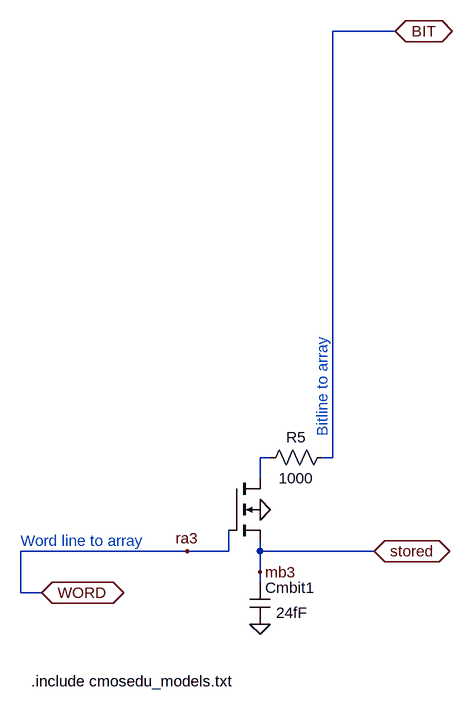
[diagram p0: schematic DRAM_cell.asc]
DRAM_cell.asc, the LTspice schematic file:
Version 4
SHEET 1 1952 1352
WIRE 1408 -528 1312 -528
WIRE 1216 128 1200 128
WIRE 1312 128 1312 -528
WIRE 1312 128 1296 128
WIRE 1200 160 1200 128
WIRE 1088 272 832 272
WIRE 1152 272 1152 240
WIRE 1152 272 1088 272
WIRE 1200 272 1200 256
WIRE 1376 272 1200 272
WIRE 1200 304 1200 272
WIRE 1200 320 1200 304
WIRE 832 336 832 272
WIRE 864 336 832 336
FLAG 1200 208 0
FLAG 1200 384 0
FLAG 1200 304 mb3
FLAG 1088 272 ra3
FLAG 1408 -528 BIT
IOPIN 1408 -528 BiDir
FLAG 864 336 WORD
IOPIN 864 336 BiDir
FLAG 1376 272 stored
IOPIN 1376 272 BiDir
SYMBOL nmos4 1152 160 R0
WINDOW 0 104 24 Invisible 2
WINDOW 3 179 41 Invisible 2
SYMATTR InstName M8
SYMATTR Value nmos45lp
SYMATTR Value2 l=0.085um w=0.055um
SYMBOL cap 1184 320 R0
WINDOW 3 41 47 Left 2
SYMATTR Value 24fF
SYMATTR InstName Cmbit1
SYMBOL res 1312 112 R90
WINDOW 0 0 56 VBottom 2
WINDOW 3 32 56 VTop 2
SYMATTR InstName R5
SYMATTR Value 1000
TEXT 1296 96 VLeft 2 ;Bitline to array
TEXT 832 256 Left 2 ;Word line to array
TEXT 848 472 Left 2 !.include cmosedu_models.txt

The netlist it stands for:
* DRAM_cell.asc
M8 N001 WORD stored 0 nmos45lp l=0.085um w=0.055um
Cmbit1 stored 0 24fF
R5 BIT N001 1000
.model NMOS NMOS
.model PMOS PMOS
.lib standard.mos
* Bitline to array
* Word line to array
.include cmosedu_models.txt
.backanno
.end